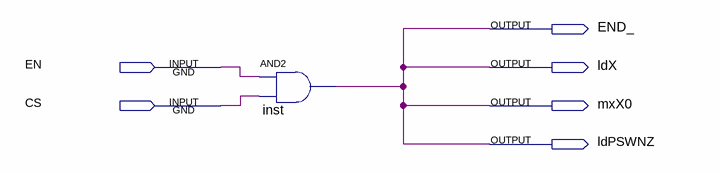
[diagram p0: schematic sheet]
// Quartus schematic TAX.bdf as structural Verilog: 1 symbols, 6 pins
module TAX (
  input  EN,
  input  CS,
  output END_,
  output ldX,
  output mxX0,
  output ldPSWNZ
);

  and inst (END_, EN, CS);

  assign ldPSWNZ = END_;
  assign ldX = END_;
  assign mxX0 = END_;
endmodule
